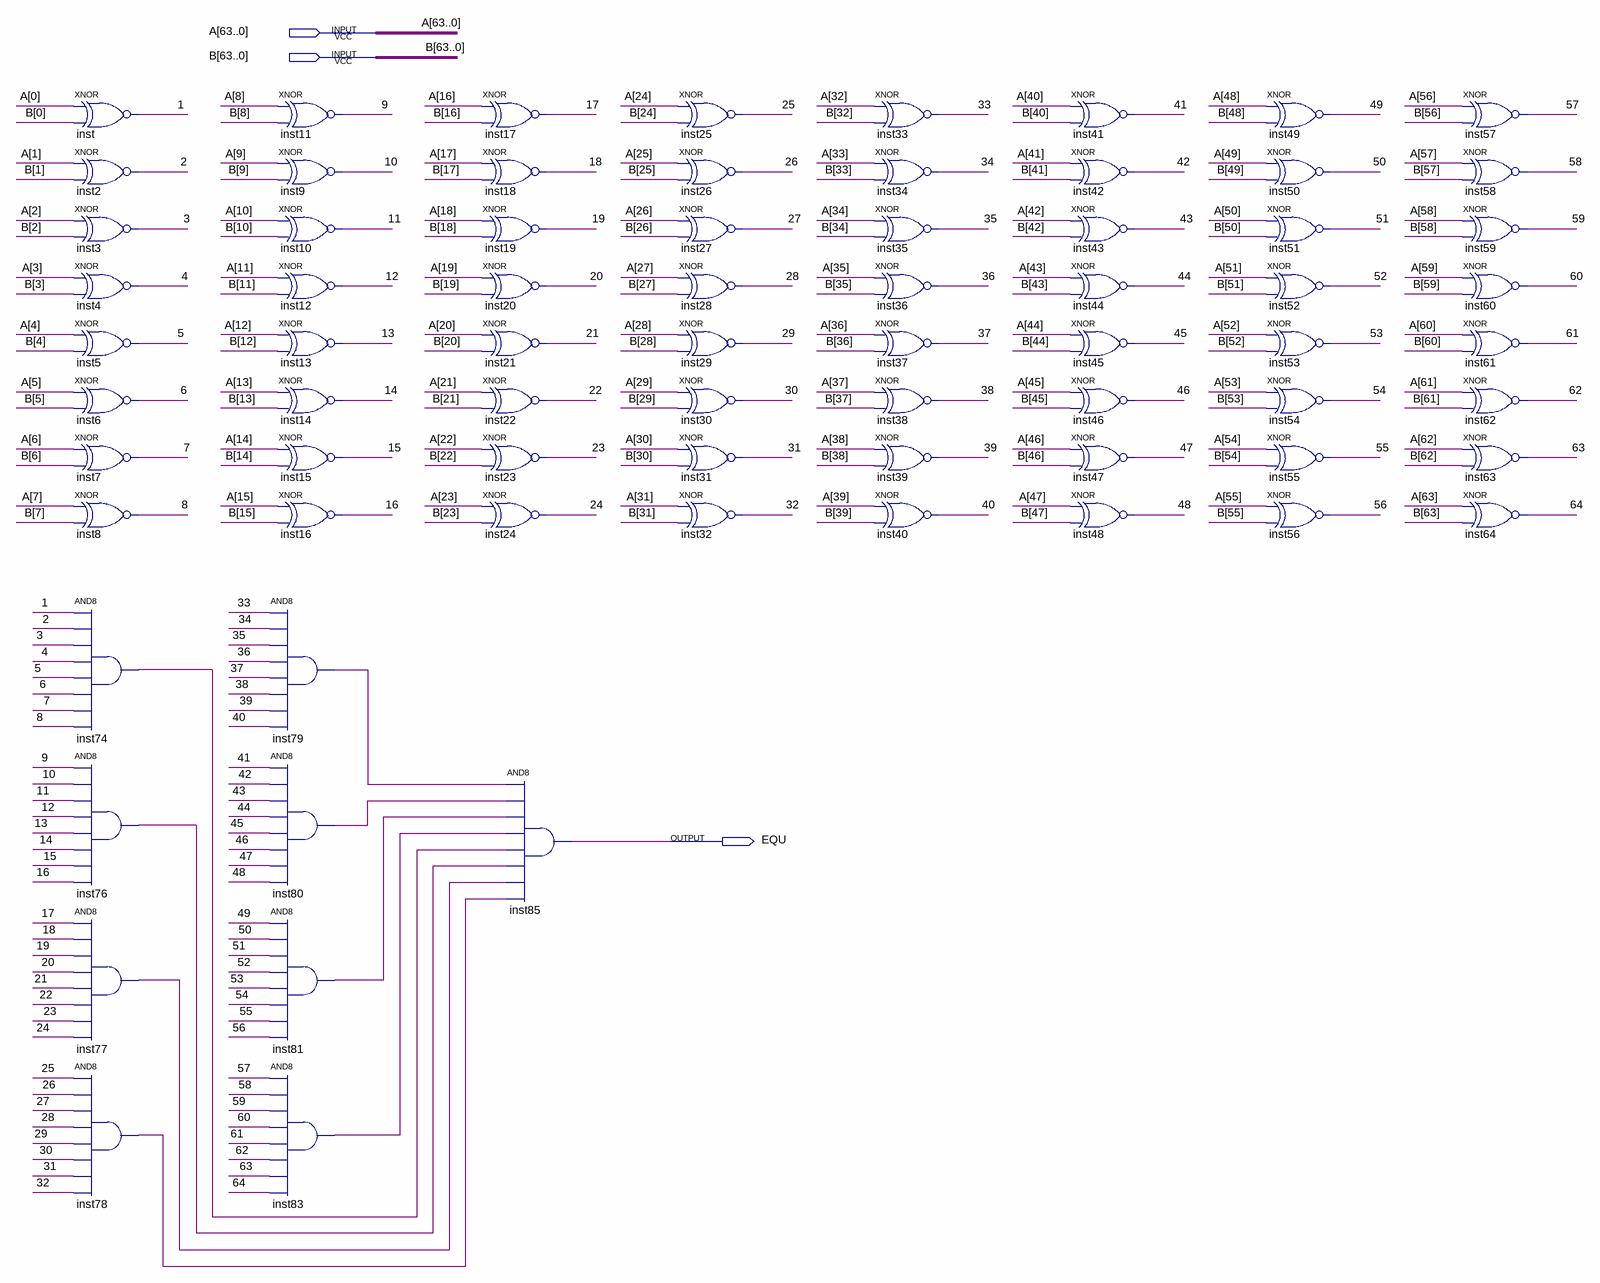
[diagram p0: schematic sheet]
// Quartus schematic EQUAL.bdf as structural Verilog: 73 symbols, 3 pins
module EQUAL (
  input  [63:0] A,
  input  [63:0] B,
  output EQU
);

  wire \1 , \2 , \3 , \4 , \5 , \6 , \7 , \8 , \9 , \10 , \11 , \12 , \13 , \14 , \15 , \16 , \17 , \18 ,
       \19 , \20 , \21 , \22 , \23 , \24 , \25 , \26 , \27 , \28 , \29 , \30 , \31 , \32 , \33 , \34 , \35 ,
       \36 , \37 , \38 , \39 , \40 , \41 , \42 , \43 , \44 , \45 , \46 , \47 , \48 , \49 , \50 , \51 , \52 ,
       \53 , \54 , \55 , \56 , \57 , \58 , \59 , \60 , \61 , \62 , \63 , \64 , inst74_out, inst76_out,
       inst77_out, inst78_out, inst79_out, inst80_out, inst81_out, inst83_out;

  xnor inst (\1 , A[0], B[0]);
  xnor inst2 (\2 , A[1], B[1]);
  xnor inst3 (\3 , A[2], B[2]);
  xnor inst4 (\4 , A[3], B[3]);
  xnor inst5 (\5 , A[4], B[4]);
  xnor inst6 (\6 , A[5], B[5]);
  xnor inst7 (\7 , A[6], B[6]);
  xnor inst8 (\8 , A[7], B[7]);
  and inst74 (inst74_out, \1 , \2 , \3 , \4 , \5 , \6 , \7 , \8 );
  and inst76 (inst76_out, \9 , \10 , \11 , \12 , \13 , \14 , \15 , \16 );
  and inst77 (inst77_out, \17 , \18 , \19 , \20 , \21 , \22 , \23 , \24 );
  and inst78 (inst78_out, \25 , \26 , \27 , \28 , \29 , \30 , \31 , \32 );
  xnor inst11 (\9 , A[8], B[8]);
  xnor inst9 (\10 , A[9], B[9]);
  xnor inst10 (\11 , A[10], B[10]);
  xnor inst12 (\12 , A[11], B[11]);
  xnor inst13 (\13 , A[12], B[12]);
  xnor inst14 (\14 , A[13], B[13]);
  xnor inst15 (\15 , A[14], B[14]);
  xnor inst16 (\16 , A[15], B[15]);
  and inst79 (inst79_out, \33 , \34 , \35 , \36 , \37 , \38 , \39 , \40 );
  and inst80 (inst80_out, \41 , \42 , \43 , \44 , \45 , \46 , \47 , \48 );
  and inst81 (inst81_out, \49 , \50 , \51 , \52 , \53 , \54 , \55 , \56 );
  and inst83 (inst83_out, \57 , \58 , \59 , \60 , \61 , \62 , \63 , \64 );
  xnor inst17 (\17 , A[16], B[16]);
  xnor inst18 (\18 , A[17], B[17]);
  xnor inst19 (\19 , A[18], B[18]);
  xnor inst20 (\20 , A[19], B[19]);
  xnor inst21 (\21 , A[20], B[20]);
  xnor inst22 (\22 , A[21], B[21]);
  xnor inst23 (\23 , A[22], B[22]);
  xnor inst24 (\24 , A[23], B[23]);
  and inst85 (EQU, inst79_out, inst80_out, inst81_out, inst83_out, inst74_out, inst76_out, inst77_out, inst78_out);
  xnor inst25 (\25 , A[24], B[24]);
  xnor inst26 (\26 , A[25], B[25]);
  xnor inst27 (\27 , A[26], B[26]);
  xnor inst28 (\28 , A[27], B[27]);
  xnor inst29 (\29 , A[28], B[28]);
  xnor inst30 (\30 , A[29], B[29]);
  xnor inst31 (\31 , A[30], B[30]);
  xnor inst32 (\32 , A[31], B[31]);
  xnor inst33 (\33 , A[32], B[32]);
  xnor inst34 (\34 , A[33], B[33]);
  xnor inst35 (\35 , A[34], B[34]);
  xnor inst36 (\36 , A[35], B[35]);
  xnor inst37 (\37 , A[36], B[36]);
  xnor inst38 (\38 , A[37], B[37]);
  xnor inst39 (\39 , A[38], B[38]);
  xnor inst40 (\40 , A[39], B[39]);
  xnor inst41 (\41 , A[40], B[40]);
  xnor inst42 (\42 , A[41], B[41]);
  xnor inst43 (\43 , A[42], B[42]);
  xnor inst44 (\44 , A[43], B[43]);
  xnor inst45 (\45 , A[44], B[44]);
  xnor inst46 (\46 , A[45], B[45]);
  xnor inst47 (\47 , A[46], B[46]);
  xnor inst48 (\48 , A[47], B[47]);
  xnor inst49 (\49 , A[48], B[48]);
  xnor inst50 (\50 , A[49], B[49]);
  xnor inst51 (\51 , A[50], B[50]);
  xnor inst52 (\52 , A[51], B[51]);
  xnor inst53 (\53 , A[52], B[52]);
  xnor inst54 (\54 , A[53], B[53]);
  xnor inst55 (\55 , A[54], B[54]);
  xnor inst56 (\56 , A[55], B[55]);
  xnor inst57 (\57 , A[56], B[56]);
  xnor inst58 (\58 , A[57], B[57]);
  xnor inst59 (\59 , A[58], B[58]);
  xnor inst60 (\60 , A[59], B[59]);
  xnor inst61 (\61 , A[60], B[60]);
  xnor inst62 (\62 , A[61], B[61]);
  xnor inst63 (\63 , A[62], B[62]);
  xnor inst64 (\64 , A[63], B[63]);
endmodule
